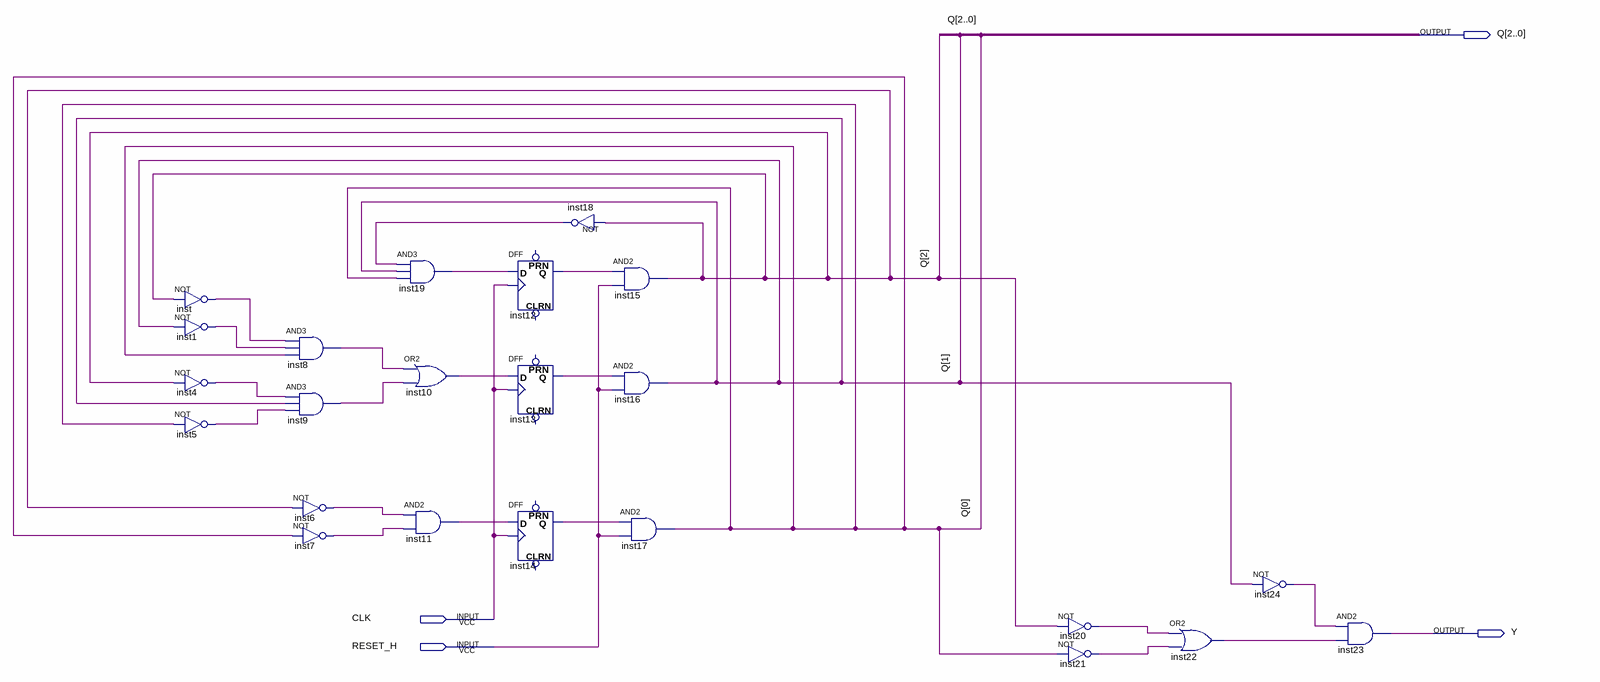
[diagram p0: schematic sheet]
// Quartus schematic DEF.bdf as structural Verilog: 23 symbols, 4 pins
module DEF (
  input  CLK,
  input  RESET_H,
  output [2:0] Q,
  output Y
);

  wire inst1_out, inst4_out, inst5_out, inst6_out, inst7_out, inst8_out, inst9_out, inst10_out, inst11_out,
       inst12_q, inst13_q, inst14_q, inst18_out, inst19_out, inst20_out, inst21_out, inst22_out, inst24_out,
       inst_out;

  not inst (inst_out, Q[2]);
  not inst1 (inst1_out, Q[1]);
  not inst4 (inst4_out, Q[2]);
  not inst5 (inst5_out, Q[0]);
  and inst8 (inst8_out, inst_out, inst1_out, Q[0]);
  and inst9 (inst9_out, inst4_out, Q[1], inst5_out);
  not inst6 (inst6_out, Q[2]);
  not inst7 (inst7_out, Q[0]);
  and inst19 (inst19_out, inst18_out, Q[1], Q[0]);
  or inst10 (inst10_out, inst8_out, inst9_out);
  and inst11 (inst11_out, inst6_out, inst7_out);
  DFF inst12 (.CLK(CLK), .D(inst19_out), .Q(inst12_q));  // open: CLRN, PRN
  DFF inst13 (.CLK(CLK), .D(inst10_out), .Q(inst13_q));  // open: CLRN, PRN
  DFF inst14 (.CLK(CLK), .D(inst11_out), .Q(inst14_q));  // open: CLRN, PRN
  not inst18 (inst18_out, Q[2]);
  and inst15 (Q[2], inst12_q, RESET_H);
  and inst16 (Q[1], inst13_q, RESET_H);
  and inst17 (Q[0], inst14_q, RESET_H);
  not inst20 (inst20_out, Q[2]);
  not inst21 (inst21_out, Q[0]);
  or inst22 (inst22_out, inst20_out, inst21_out);
  not inst24 (inst24_out, Q[1]);
  and inst23 (Y, inst24_out, inst22_out);
endmodule
